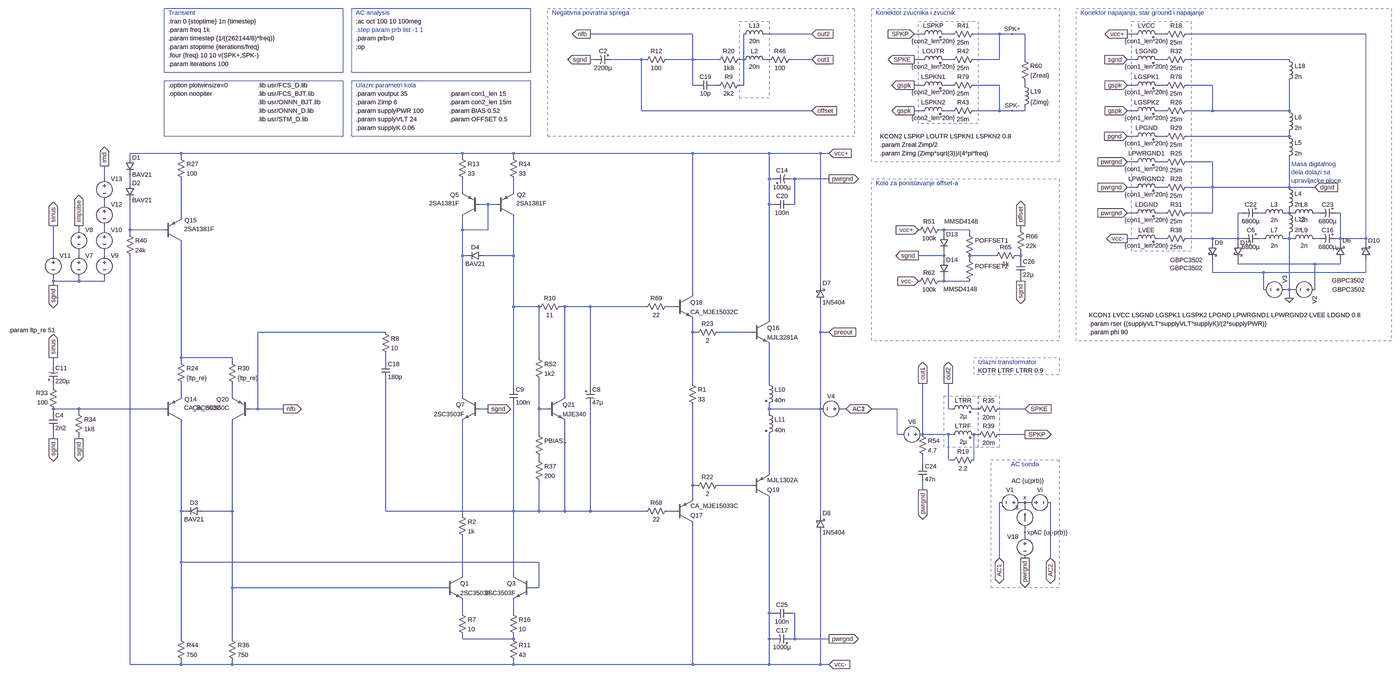
[diagram p0: schematic nano.asc, whole sheet]
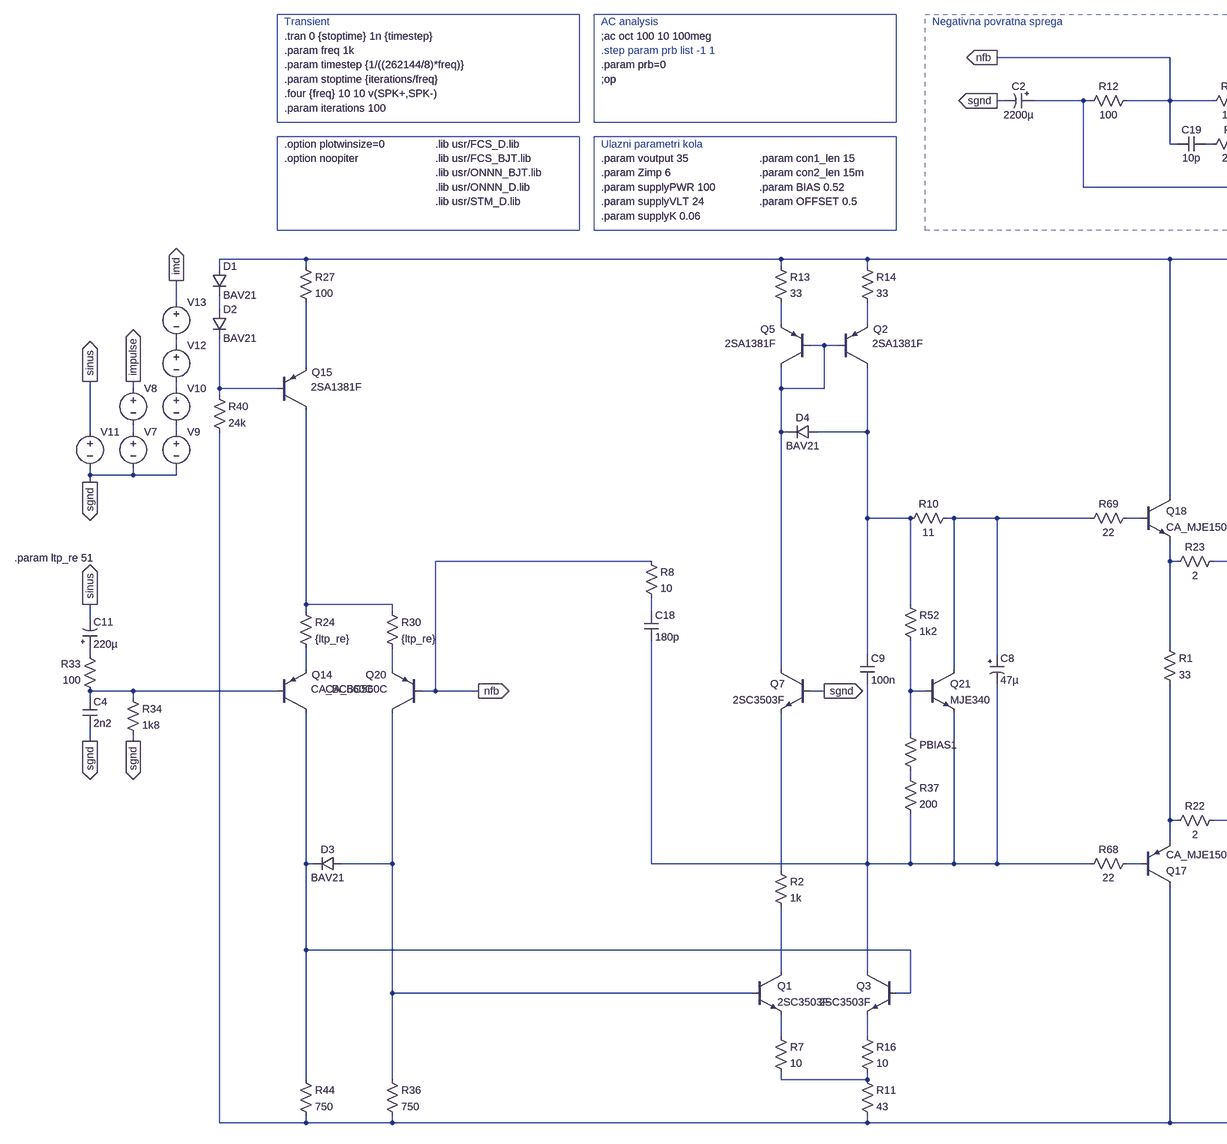
[diagram p1: schematic nano.asc, part, row 1 of 1, column 1 of 2]
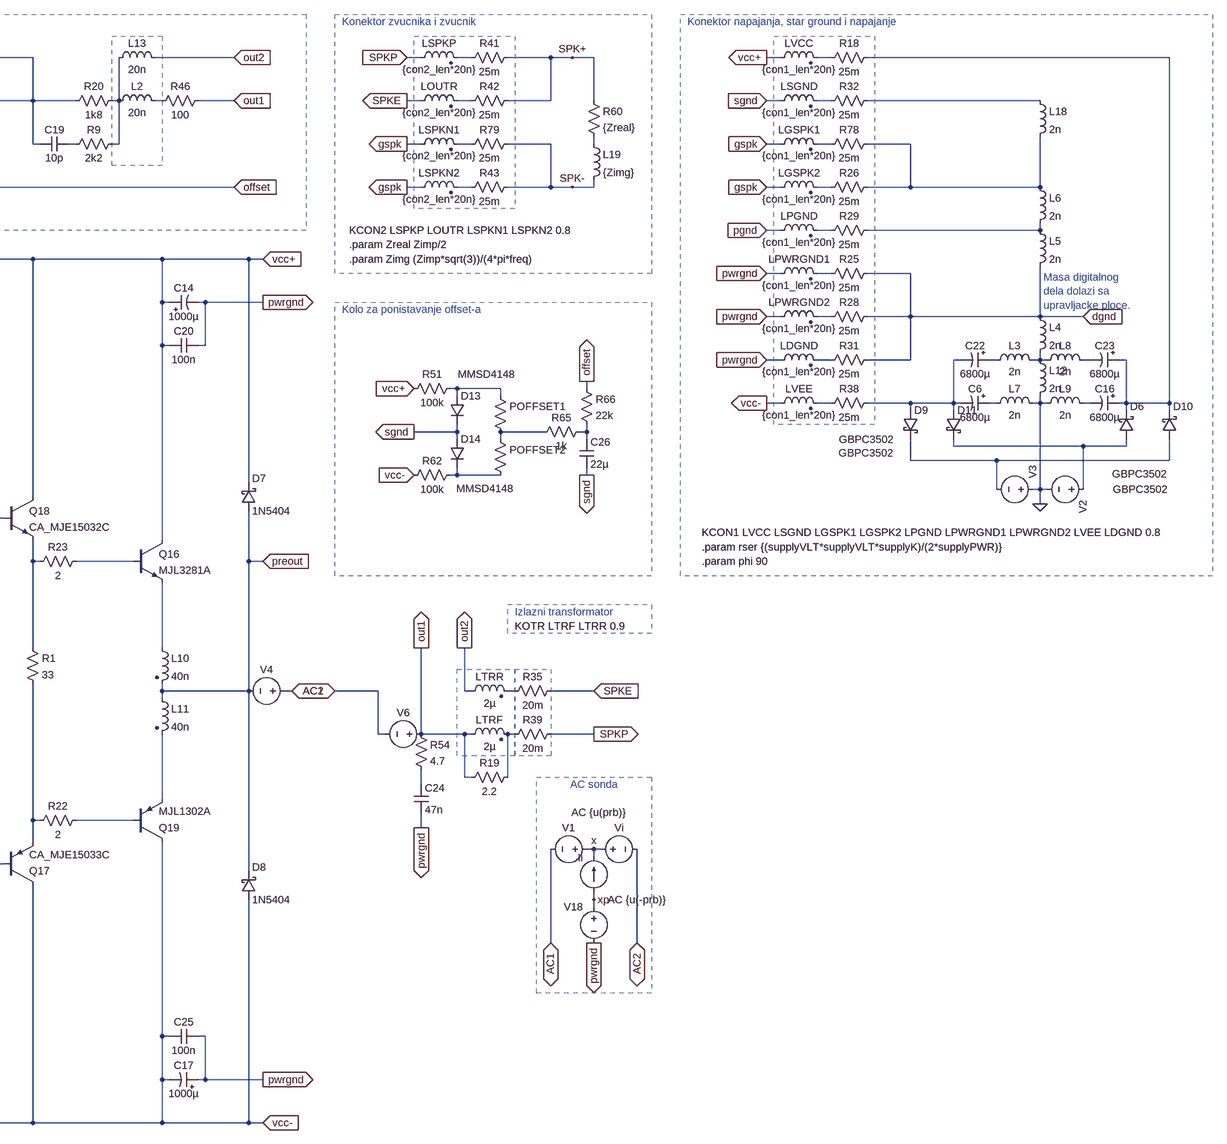
[diagram p2: schematic nano.asc, part, row 1 of 1, column 2 of 2]
nano.asc, the LTspice schematic file:
Version 4
SHEET 1 6124 2336
WIRE 1216 -1536 832 -1536
WIRE 1664 -1536 1488 -1536
WIRE 2080 -1536 2048 -1536
WIRE 2192 -1536 2160 -1536
WIRE 2368 -1536 2272 -1536
WIRE 2416 -1536 2368 -1536
WIRE 2464 -1536 2416 -1536
WIRE 2880 -1536 2848 -1536
WIRE 2992 -1536 2960 -1536
WIRE 3744 -1536 3072 -1536
WIRE 848 -1440 832 -1440
WIRE 1024 -1440 912 -1440
WIRE 1040 -1440 1024 -1440
WIRE 1216 -1440 1216 -1536
WIRE 1216 -1440 1120 -1440
WIRE 1312 -1440 1216 -1440
WIRE 1408 -1440 1408 -1536
WIRE 1408 -1440 1392 -1440
WIRE 1504 -1440 1488 -1440
WIRE 1664 -1440 1584 -1440
WIRE 2080 -1440 2048 -1440
WIRE 2192 -1440 2160 -1440
WIRE 2368 -1440 2368 -1536
WIRE 2368 -1440 2272 -1440
WIRE 2464 -1440 2464 -1536
WIRE 2880 -1440 2848 -1440
WIRE 2992 -1440 2960 -1440
WIRE 3456 -1440 3072 -1440
WIRE 1216 -1344 1216 -1440
WIRE 1232 -1344 1216 -1344
WIRE 1312 -1344 1296 -1344
WIRE 1408 -1344 1408 -1440
WIRE 1408 -1344 1392 -1344
WIRE 2080 -1344 2048 -1344
WIRE 2192 -1344 2160 -1344
WIRE 2368 -1344 2272 -1344
WIRE 2464 -1344 2464 -1360
WIRE 2880 -1344 2848 -1344
WIRE 2992 -1344 2960 -1344
WIRE 3168 -1344 3072 -1344
WIRE 1024 -1248 1024 -1440
WIRE 1664 -1248 1024 -1248
WIRE 2080 -1248 2048 -1248
WIRE 2192 -1248 2160 -1248
WIRE 2368 -1248 2368 -1344
WIRE 2368 -1248 2272 -1248
WIRE 2416 -1248 2368 -1248
WIRE 2464 -1248 2464 -1264
WIRE 2464 -1248 2416 -1248
WIRE 2880 -1248 2848 -1248
WIRE 2992 -1248 2960 -1248
WIRE 3168 -1248 3168 -1344
WIRE 3168 -1248 3072 -1248
WIRE 3456 -1248 3456 -1360
WIRE 3456 -1248 3168 -1248
WIRE 2880 -1152 2848 -1152
WIRE 2992 -1152 2960 -1152
WIRE 3456 -1152 3456 -1168
WIRE 3456 -1152 3072 -1152
WIRE -704 -1088 -896 -1088
WIRE 352 -1088 -704 -1088
WIRE 544 -1088 352 -1088
WIRE 1216 -1088 544 -1088
WIRE 1344 -1088 1216 -1088
WIRE 1504 -1088 1344 -1088
WIRE 1696 -1088 1504 -1088
WIRE 1728 -1088 1696 -1088
WIRE -896 -1072 -896 -1088
WIRE -704 -1072 -704 -1088
WIRE 352 -1072 352 -1088
WIRE 544 -1072 544 -1088
WIRE 2880 -1056 2848 -1056
WIRE 2992 -1056 2960 -1056
WIRE 3168 -1056 3072 -1056
WIRE -992 -992 -992 -1040
WIRE 1504 -992 1504 -1088
WIRE 1520 -992 1504 -992
WIRE 1600 -992 1584 -992
WIRE 1728 -992 1600 -992
WIRE -896 -976 -896 -1008
WIRE 2880 -960 2848 -960
WIRE 2992 -960 2960 -960
WIRE 3168 -960 3168 -1056
WIRE 3168 -960 3072 -960
WIRE 3456 -960 3456 -1072
WIRE 3456 -960 3168 -960
WIRE 3552 -960 3456 -960
WIRE 352 -944 352 -992
WIRE 544 -944 544 -992
WIRE -992 -896 -992 -912
WIRE 448 -896 416 -896
WIRE 480 -896 448 -896
WIRE 1504 -896 1504 -992
WIRE 1520 -896 1504 -896
WIRE 1600 -896 1600 -992
WIRE 1600 -896 1584 -896
WIRE 2880 -864 2848 -864
WIRE 2992 -864 2960 -864
WIRE 3168 -864 3168 -960
WIRE 3168 -864 3072 -864
WIRE 3280 -864 3264 -864
WIRE 3360 -864 3344 -864
WIRE 3456 -864 3456 -880
WIRE 3456 -864 3440 -864
WIRE 3472 -864 3456 -864
WIRE 3568 -864 3552 -864
WIRE 3648 -864 3632 -864
WIRE -704 -848 -704 -992
WIRE -1088 -800 -1088 -816
WIRE -992 -800 -992 -816
WIRE -896 -800 -896 -912
WIRE -768 -800 -896 -800
WIRE 352 -800 352 -848
WIRE 448 -800 448 -896
WIRE 448 -800 352 -800
WIRE 2160 -800 2144 -800
WIRE 2256 -800 2160 -800
WIRE 2448 -800 2448 -816
WIRE -896 -784 -896 -800
WIRE 2160 -784 2160 -800
WIRE 2256 -784 2256 -800
WIRE 2880 -768 2848 -768
WIRE 2992 -768 2960 -768
WIRE 3168 -768 3072 -768
WIRE 3264 -768 3264 -864
WIRE 3264 -768 3168 -768
WIRE 3280 -768 3264 -768
WIRE 3360 -768 3344 -768
WIRE 3456 -768 3456 -784
WIRE 3456 -768 3440 -768
WIRE 3472 -768 3456 -768
WIRE 3568 -768 3552 -768
WIRE 3648 -768 3648 -864
WIRE 3648 -768 3632 -768
WIRE 3744 -768 3744 -1536
WIRE 3744 -768 3648 -768
WIRE 3168 -752 3168 -768
WIRE 3264 -752 3264 -768
WIRE 3648 -752 3648 -768
WIRE 3744 -752 3744 -768
WIRE -1184 -704 -1184 -816
WIRE -1088 -704 -1088 -720
WIRE -992 -704 -992 -720
WIRE 352 -704 352 -800
WIRE 368 -704 352 -704
WIRE 544 -704 544 -848
WIRE 544 -704 432 -704
WIRE 1216 -704 1216 -1088
WIRE 1504 -704 1504 -896
WIRE 2160 -704 2160 -720
WIRE 2160 -704 2064 -704
WIRE 2352 -704 2256 -704
WIRE 2448 -704 2448 -720
WIRE 2448 -704 2432 -704
WIRE 2160 -688 2160 -704
WIRE 2256 -688 2256 -704
WIRE 2448 -688 2448 -704
WIRE 3264 -672 3264 -688
WIRE 3552 -672 3264 -672
WIRE 3648 -672 3648 -688
WIRE 3648 -672 3552 -672
WIRE 3168 -640 3168 -688
WIRE 3360 -640 3168 -640
WIRE 3744 -640 3744 -688
WIRE 3744 -640 3360 -640
WIRE -1184 -608 -1184 -624
WIRE -1088 -608 -1088 -624
WIRE -1088 -608 -1184 -608
WIRE -992 -608 -992 -624
WIRE -992 -608 -1088 -608
WIRE 2160 -608 2160 -624
WIRE 2160 -608 2144 -608
WIRE 2256 -608 2160 -608
WIRE 2448 -608 2448 -624
WIRE -1184 -592 -1184 -608
WIRE 1696 -592 1696 -1088
WIRE 3360 -576 3360 -640
WIRE 3456 -576 3456 -768
WIRE 3456 -576 3440 -576
WIRE 3472 -576 3456 -576
WIRE 3552 -576 3552 -672
WIRE 1216 -560 1216 -704
WIRE 3456 -544 3456 -576
WIRE 544 -512 544 -704
WIRE 640 -512 544 -512
WIRE 736 -512 720 -512
WIRE 832 -512 736 -512
WIRE 1040 -512 832 -512
WIRE 1152 -512 1120 -512
WIRE 1504 -464 1504 -704
WIRE 64 -416 -416 -416
WIRE 1216 -416 1216 -464
WIRE 1232 -416 1216 -416
WIRE 1440 -416 1312 -416
WIRE 1696 -416 1696 -528
WIRE 1728 -416 1696 -416
WIRE -704 -320 -704 -752
WIRE -512 -320 -704 -320
WIRE 640 -320 640 -512
WIRE -704 -304 -704 -320
WIRE -512 -304 -512 -320
WIRE 64 -304 64 -336
WIRE -1184 -288 -1184 -320
WIRE 1216 -224 1216 -416
WIRE 1504 -224 1504 -368
WIRE -1184 -208 -1184 -224
WIRE 544 -208 544 -512
WIRE 832 -208 832 -512
WIRE -704 -176 -704 -224
WIRE -512 -176 -512 -224
WIRE 352 -176 352 -704
WIRE 736 -176 736 -512
WIRE -1088 -128 -1184 -128
WIRE -768 -128 -1088 -128
WIRE -416 -128 -416 -416
WIRE -416 -128 -448 -128
WIRE -320 -128 -416 -128
WIRE 448 -128 416 -128
WIRE 640 -128 640 -240
WIRE 672 -128 640 -128
WIRE 1504 -128 1504 -144
WIRE 1600 -128 1504 -128
WIRE 1696 -128 1696 -416
WIRE 1696 -128 1600 -128
WIRE 1792 -128 1776 -128
WIRE 1984 -128 1888 -128
WIRE 2176 -128 2176 -224
WIRE 2192 -128 2176 -128
WIRE 2288 -128 2272 -128
WIRE 2464 -128 2368 -128
WIRE -1184 -112 -1184 -128
WIRE -1088 -112 -1088 -128
WIRE 1504 -112 1504 -128
WIRE 640 -32 640 -128
WIRE 1984 -32 1984 -128
WIRE 2000 -32 1984 -32
WIRE 2080 -32 2080 -224
WIRE 2176 -32 2080 -32
WIRE 2192 -32 2176 -32
WIRE 2288 -32 2272 -32
WIRE 2464 -32 2368 -32
WIRE -1184 -16 -1184 -48
WIRE -1088 -16 -1088 -32
WIRE 640 64 640 48
WIRE 2176 64 2176 -32
WIRE 2192 64 2176 64
WIRE 2272 64 2272 -32
WIRE 2080 80 2080 48
WIRE 1504 112 1504 -32
WIRE 1216 160 1216 -144
WIRE 1232 160 1216 160
WIRE 1440 160 1312 160
WIRE 2080 176 2080 144
WIRE 1216 208 1216 160
WIRE 2464 224 2448 224
WIRE 2480 224 2464 224
WIRE 2464 240 2464 224
WIRE -704 256 -704 -80
WIRE -688 256 -704 256
WIRE -512 256 -512 -80
WIRE -512 256 -624 256
WIRE 64 256 64 -240
WIRE 544 256 544 -144
WIRE 544 256 64 256
WIRE 640 256 640 144
WIRE 640 256 544 256
WIRE 736 256 736 -80
WIRE 736 256 640 256
WIRE 832 256 832 -144
WIRE 832 256 736 256
WIRE 1040 256 832 256
WIRE 1152 256 1120 256
WIRE 352 272 352 -80
WIRE 1696 272 1696 -128
WIRE 2464 336 2464 320
WIRE 2464 352 2464 336
WIRE 2368 432 2368 224
WIRE 2560 432 2560 224
WIRE -704 448 -704 256
WIRE 640 448 -704 448
WIRE 352 496 352 352
WIRE 544 496 544 256
WIRE -512 544 -512 256
WIRE 288 544 -512 544
WIRE 640 544 640 448
WIRE 640 544 608 544
WIRE 352 640 352 592
WIRE 544 640 544 592
WIRE 1504 640 1504 208
WIRE 1520 640 1504 640
WIRE 1600 640 1584 640
WIRE -704 736 -704 448
WIRE -512 736 -512 544
WIRE 352 736 352 720
WIRE 544 736 544 720
WIRE 544 736 352 736
WIRE 1504 736 1504 640
WIRE 1520 736 1504 736
WIRE 1600 736 1600 640
WIRE 1600 736 1584 736
WIRE 1728 736 1600 736
WIRE -896 832 -896 -704
WIRE -704 832 -704 816
WIRE -704 832 -896 832
WIRE -512 832 -512 816
WIRE -512 832 -704 832
WIRE 544 832 544 816
WIRE 544 832 -512 832
WIRE 1216 832 1216 304
WIRE 1216 832 544 832
WIRE 1344 832 1216 832
WIRE 1504 832 1504 736
WIRE 1504 832 1344 832
WIRE 1696 832 1696 336
WIRE 1696 832 1504 832
WIRE 1728 832 1696 832
FLAG 1728 -1088 vcc+
IOPIN 1728 -1088 In
FLAG 2464 224 x
FLAG 1728 832 vcc-
IOPIN 1728 832 In
FLAG 2080 -224 out1
IOPIN 2080 -224 Out
FLAG 832 -1536 nfb
IOPIN 832 -1536 Out
FLAG -320 -128 nfb
IOPIN -320 -128 Out
FLAG 2464 336 xp
FLAG 2080 176 pwrgnd
IOPIN 2080 176 Out
FLAG -1184 -16 sgnd
IOPIN -1184 -16 Out
FLAG -1088 -16 sgnd
IOPIN -1088 -16 Out
FLAG 832 -1440 sgnd
IOPIN 832 -1440 Out
FLAG 1728 -992 pwrgnd
IOPIN 1728 -992 Out
FLAG 2176 -224 out2
IOPIN 2176 -224 Out
FLAG -1184 -592 sgnd
IOPIN -1184 -592 Out
FLAG -1184 -816 sinus
IOPIN -1184 -816 Out
FLAG 1728 736 pwrgnd
IOPIN 1728 736 Out
FLAG 2848 -1536 vcc+
IOPIN 2848 -1536 Out
FLAG 2848 -768 vcc-
IOPIN 2848 -768 Out
FLAG 2848 -1248 gspk
IOPIN 2848 -1248 In
FLAG 2848 -960 pwrgnd
IOPIN 2848 -960 In
FLAG 2848 -1152 pgnd
IOPIN 2848 -1152 In
FLAG 2848 -1440 sgnd
IOPIN 2848 -1440 In
FLAG 1664 -1440 out1
IOPIN 1664 -1440 In
FLAG 1664 -1536 out2
IOPIN 1664 -1536 In
FLAG 2464 -32 SPKP
IOPIN 2464 -32 Out
FLAG 2048 -1248 gspk
IOPIN 2048 -1248 Out
FLAG 2048 -1536 SPKP
IOPIN 2048 -1536 In
FLAG 2048 -1440 SPKE
IOPIN 2048 -1440 Out
FLAG 3552 -960 dgnd
IOPIN 3552 -960 In
FLAG 2848 -1056 pwrgnd
IOPIN 2848 -1056 In
FLAG -1088 -816 impulse
IOPIN -1088 -816 Out
FLAG 2848 -864 pwrgnd
IOPIN 2848 -864 In
FLAG 3456 -544 0
FLAG 2064 -800 vcc+
IOPIN 2064 -800 In
FLAG 2064 -608 vcc-
IOPIN 2064 -608 In
FLAG 2064 -704 sgnd
IOPIN 2064 -704 Out
FLAG 2448 -608 sgnd
IOPIN 2448 -608 Out
FLAG 2448 -816 offset
IOPIN 2448 -816 Out
FLAG 1664 -1248 offset
IOPIN 1664 -1248 In
FLAG 2368 432 AC1
IOPIN 2368 432 BiDir
FLAG 2560 432 AC2
IOPIN 2560 432 BiDir
FLAG 1792 -128 AC1
IOPIN 1792 -128 BiDir
FLAG 1888 -128 AC2
IOPIN 1888 -128 BiDir
FLAG 2464 432 pwrgnd
IOPIN 2464 432 Out
FLAG 2416 -1536 SPK+
FLAG 2416 -1248 SPK-
FLAG 2464 -128 SPKE
IOPIN 2464 -128 In
FLAG 2848 -1344 gspk
IOPIN 2848 -1344 In
FLAG 2048 -1344 gspk
IOPIN 2048 -1344 Out
FLAG 1728 -416 preout
IOPIN 1728 -416 In
FLAG -992 -1040 imd
IOPIN -992 -1040 Out
FLAG 448 -128 sgnd
IOPIN 448 -128 Out
FLAG -1184 -320 sinus
IOPIN -1184 -320 Out
DATAFLAG 1600 -128 ""
DATAFLAG 1504 -704 "ic(q16)"
DATAFLAG 1344 -1088 ""
DATAFLAG 1344 832 ""
DATAFLAG 1216 -704 "Ic(Q18)"
SYMBOL res 1136 -1456 R90
WINDOW 0 0 56 VBottom 2
WINDOW 3 32 56 VTop 2
SYMATTR InstName R12
SYMATTR Value 100
SYMBOL voltage 3568 -576 R90
WINDOW 123 0 0 Left 2
WINDOW 3 -94 177 Invisible 2
SYMATTR Value SINE(0 {supplyVLT*sqrt(2)} 50 0 0 {phi})
SYMATTR SpiceLine Rser={rser}
SYMATTR InstName V2
SYMBOL current 2464 320 R180
WINDOW 0 24 77 Left 2
WINDOW 3 24 0 Invisible 2
WINDOW 123 -71 178 Left 2
WINDOW 39 0 0 Left 2
SYMATTR InstName Ii
SYMATTR Value 0
SYMATTR Value2 AC {u(prb)}
SYMBOL voltage 2464 224 R270
WINDOW 0 32 56 VTop 2
WINDOW 3 -32 56 Invisible 2
WINDOW 123 -97 96 VBottom 2
WINDOW 39 -32 56 VBottom 2
SYMATTR InstName Vi
SYMATTR Value 0
SYMATTR Value2 AC {u(-prb)}
SYMBOL res -1168 -112 R180
WINDOW 0 36 76 Left 2
WINDOW 3 36 40 Left 2
SYMATTR InstName R33
SYMATTR Value 100
SYMBOL res -1104 -128 R0
SYMATTR InstName R34
SYMATTR Value 1k8
SYMBOL schottky 1680 -528 M180
WINDOW 0 24 72 Left 2
WINDOW 3 24 0 Left 2
SYMATTR InstName D7
SYMATTR Value 1N5404
SYMATTR Description Diode
SYMATTR Type diode
SYMBOL schottky 1680 336 M180
WINDOW 0 24 72 Left 2
WINDOW 3 24 0 Left 2
SYMATTR InstName D8
SYMATTR Value 1N5404
SYMATTR Description Diode
SYMATTR Type diode
SYMBOL ind2 2176 -16 R270
WINDOW 0 32 56 VTop 2
WINDOW 3 4 56 VBottom 2
SYMATTR InstName LTRF
SYMATTR Value 2µ
SYMATTR SpiceLine Rser=10m Rpar=3meg Cpar=1p
SYMATTR Type ind
SYMBOL res 2176 80 R270
WINDOW 0 32 56 VTop 2
WINDOW 3 0 56 VBottom 2
SYMATTR InstName R19
SYMATTR Value 2.2
SYMBOL res 1408 -1456 R90
WINDOW 0 0 56 VBottom 2
WINDOW 3 32 56 VTop 2
SYMATTR InstName R20
SYMATTR Value 1k8
SYMBOL voltage 2464 224 R90
WINDOW 0 -32 56 VBottom 2
WINDOW 3 32 56 Invisible 2
WINDOW 123 0 0 Left 2
WINDOW 39 0 0 Left 2
SYMATTR InstName V1
SYMATTR Value 0
SYMBOL schottky 3632 -688 M180
WINDOW 0 24 72 Left 2
WINDOW 3 -14 -112 Left 2
SYMATTR InstName D6
SYMATTR Value GBPC3502
SYMATTR Description Diode
SYMATTR Type diode
SYMBOL schottky 3152 -752 R0
WINDOW 3 -144 95 Left 2
SYMATTR Value GBPC3502
SYMATTR InstName D9
SYMATTR Description Diode
SYMATTR Type diode
SYMBOL voltage 3456 -576 M270
WINDOW 123 0 0 Left 2
WINDOW 3 -96 -62 Invisible 2
SYMATTR Value SINE(0 {supplyVLT*sqrt(2)} 50 0 0 {phi})
SYMATTR SpiceLine Rser={rser}
SYMATTR InstName V3
SYMBOL res 2064 -48 R0
SYMATTR InstName R54
SYMATTR Value 4.7
SYMBOL res 2448 -1456 R0
SYMATTR InstName R60
SYMATTR Value {Zreal}
SYMBOL ind 2448 -1360 R0
SYMATTR InstName L19
SYMATTR Value {Zimg}
SYMATTR SpiceLine Cpar=10p
SYMBOL voltage 2464 336 M0
WINDOW 123 0 0 Left 2
WINDOW 39 0 0 Left 2
WINDOW 3 24 96 Invisible 2
SYMATTR Value 0
SYMATTR InstName V18
SYMBOL npn 1440 -464 R0
SYMATTR InstName Q16
SYMATTR Value MJL3281A
SYMBOL pnp 1152 304 M180
SYMATTR InstName Q17
SYMATTR Value CA_MJE15033C
SYMBOL npn 1152 -560 R0
SYMATTR InstName Q18
SYMATTR Value CA_MJE15032C
SYMBOL pnp 1440 208 M180
SYMATTR InstName Q19
SYMATTR Value MJL1302A
SYMBOL res 1328 144 R90
WINDOW 0 0 56 VBottom 2
WINDOW 3 32 56 VTop 2
SYMATTR InstName R22
SYMATTR Value 2
SYMBOL res 1328 -432 R90
WINDOW 0 0 56 VBottom 2
WINDOW 3 32 56 VTop 2
SYMATTR InstName R23
SYMATTR Value 2
SYMBOL cap 1520 -912 M90
WINDOW 0 0 32 VBottom 2
WINDOW 3 32 32 VTop 2
SYMATTR InstName C20
SYMATTR Value 100n
SYMATTR SpiceLine Rser=700m Lser=7n Rpar=4.4meg Cpar=1p
SYMBOL ind2 1488 -240 R0
SYMATTR InstName L10
SYMATTR Value 40n
SYMATTR SpiceLine Rser=220m Cpar=3p
SYMATTR Type ind
SYMBOL ind2 1488 -128 R0
SYMATTR InstName L11
SYMATTR Value 40n
SYMATTR SpiceLine Rser=220m Cpar=3p
SYMATTR Type ind
SYMBOL cap 2064 80 R0
SYMATTR InstName C24
SYMATTR Value 47n
SYMATTR SpiceLine Rser=700m Lser=7n Rpar=4.4meg Cpar=1p
SYMBOL cap 1584 624 R90
WINDOW 0 0 32 VBottom 2
WINDOW 3 32 32 VTop 2
SYMATTR InstName C25
SYMATTR Value 100n
SYMATTR SpiceLine Rser=700m Lser=7n Rpar=4.4meg Cpar=1p
SYMBOL polcap 912 -1456 R90
WINDOW 0 0 32 VBottom 2
WINDOW 3 32 32 VTop 2
SYMATTR InstName C2
SYMATTR Value 2200µ
SYMATTR SpiceLine V=10 Irms=1.25 Rser=0.08 Lser=10n Rpar=110k Cpar=3p
SYMATTR Description Capacitor
SYMATTR Type cap
SYMBOL polcap 3344 -784 R90
WINDOW 0 0 32 VBottom 2
WINDOW 3 32 32 VTop 2
SYMATTR InstName C6
SYMATTR Value 6800µ
SYMATTR SpiceLine V=50 Irms=2.5 Rser=0.08 Lser=20n Rpar=40k Cpar=3p mfg="Nichicon" pn="UVZ1H682MRD" type="Al electrolytic"
SYMATTR Description Capacitor
SYMATTR Type cap
SYMBOL res 624 -48 R0
WINDOW 3 36 76 Invisible 2
SYMATTR Value {1+(500*BIAS)}
SYMATTR InstName PBIAS1
SYMBOL res 624 -336 R0
SYMATTR InstName R52
SYMATTR Value 1k2
SYMBOL schottky 3728 -688 M180
WINDOW 0 24 72 Left 2
WINDOW 3 -112 -78 Left 2
SYMATTR InstName D10
SYMATTR Value GBPC3502
SYMATTR Description Diode
SYMATTR Type diode
SYMBOL schottky 3248 -752 R0
WINDOW 3 -239 65 Left 2
SYMATTR Value GBPC3502
SYMATTR InstName D11
SYMATTR Description Diode
SYMATTR Type diode
SYMBOL ind2 2864 -1520 R270
WINDOW 0 32 56 VTop 2
WINDOW 3 5 56 VBottom 2
SYMATTR InstName LVCC
SYMATTR Value {con1_len*20n}
SYMATTR SpiceLine Rser={con1_len*.5m}
SYMATTR Type ind
SYMBOL ind2 2864 -752 R270
WINDOW 0 32 56 VTop 2
WINDOW 3 5 56 VBottom 2
SYMATTR InstName LVEE
SYMATTR Value {con1_len*20n}
SYMATTR SpiceLine Rser={con1_len*.5m}
SYMATTR Type ind
SYMBOL res 1600 -1456 R90
WINDOW 0 0 56 VBottom 2
WINDOW 3 32 56 VTop 2
SYMATTR InstName R46
SYMATTR Value 100
SYMBOL ind2 2176 -112 R270
WINDOW 0 32 56 VTop 2
WINDOW 3 4 56 VBottom 2
SYMATTR InstName LTRR
SYMATTR Value 2µ
SYMATTR SpiceLine Rser=80m Rpar=3meg Cpar=1p
SYMATTR Type ind
SYMBOL npn 608 496 M0
SYMATTR InstName Q3
SYMATTR Value 2SC3503F
SYMBOL cap -1200 -48 M180
WINDOW 0 24 56 Left 2
WINDOW 3 24 8 Left 2
SYMATTR InstName C4
SYMATTR Value 2n2
SYMBOL voltage -1184 -720 R0
WINDOW 123 24 44 Left 2
WINDOW 39 0 0 Left 2
WINDOW 3 24 96 Invisible 2
SYMATTR Value SINE(0 {voutput/18} {freq})
SYMATTR InstName V11
SYMBOL res 1200 -240 R0
SYMATTR InstName R1
SYMATTR Value 33
SYMBOL npn 672 -176 R0
SYMATTR InstName Q21
SYMATTR Value MJE340
SYMBOL ind2 2864 -1232 R270
WINDOW 0 32 56 VTop 2
WINDOW 3 5 56 VBottom 2
SYMATTR InstName LGSPK2
SYMATTR Value {con1_len*20n}
SYMATTR SpiceLine Rser={con1_len*.5m}
SYMATTR Type ind
SYMBOL ind2 2864 -944 R270
WINDOW 0 32 56 VTop 2
WINDOW 3 5 56 VBottom 2
SYMATTR InstName LPWRGND2
SYMATTR Value {con1_len*20n}
SYMATTR SpiceLine Rser={con1_len*.5m}
SYMATTR Type ind
SYMBOL ind2 2864 -1136 R270
WINDOW 0 32 56 VTop 2
WINDOW 3 5 56 VBottom 2
SYMATTR InstName LPGND
SYMATTR Value {con1_len*20n}
SYMATTR SpiceLine Rser={con1_len*.5m}
SYMATTR Type ind
SYMBOL ind2 2864 -1424 R270
WINDOW 0 32 56 VTop 2
WINDOW 3 5 56 VBottom 2
SYMATTR InstName LSGND
SYMATTR Value {con1_len*20n}
SYMATTR SpiceLine Rser={con1_len*.5m}
SYMATTR Type ind
SYMBOL res 3088 -1552 R90
WINDOW 0 0 56 VBottom 2
WINDOW 3 32 56 VTop 2
SYMATTR InstName R18
SYMATTR Value 25m
SYMBOL res 3088 -1264 R90
WINDOW 0 0 56 VBottom 2
WINDOW 3 32 56 VTop 2
SYMATTR InstName R26
SYMATTR Value 25m
SYMBOL res 3088 -976 R90
WINDOW 0 0 56 VBottom 2
WINDOW 3 32 56 VTop 2
SYMATTR InstName R28
SYMATTR Value 25m
SYMBOL res 3088 -1168 R90
WINDOW 0 0 56 VBottom 2
WINDOW 3 32 56 VTop 2
SYMATTR InstName R29
SYMATTR Value 25m
SYMBOL res 3088 -1456 R90
WINDOW 0 0 56 VBottom 2
WINDOW 3 32 56 VTop 2
SYMATTR InstName R32
SYMATTR Value 25m
SYMBOL res 3088 -784 R90
WINDOW 0 0 56 VBottom 2
WINDOW 3 32 56 VTop 2
SYMATTR InstName R38
SYMATTR Value 25m
SYMBOL ind 3440 -976 R0
SYMATTR InstName L4
SYMATTR Value 2n
SYMATTR SpiceLine Rser=1m
SYMBOL ind 3440 -1168 R0
SYMATTR InstName L5
SYMATTR Value 2n
SYMATTR SpiceLine Rser=1m
SYMBOL ind 3440 -1264 R0
SYMATTR InstName L6
SYMATTR Value 2n
SYMATTR SpiceLine Rser=1m
SYMBOL ind 3440 -1456 R0
SYMATTR InstName L18
SYMATTR Value 2n
SYMATTR SpiceLine Rser=1m
SYMBOL ind2 2064 -1520 R270
WINDOW 0 32 56 VTop 2
WINDOW 3 5 56 VBottom 2
SYMATTR InstName LSPKP
SYMATTR Value {con2_len*20n}
SYMATTR SpiceLine Rser={con2_len*.5m}
SYMATTR Type ind
SYMBOL ind2 2064 -1424 R270
WINDOW 0 32 56 VTop 2
WINDOW 3 5 56 VBottom 2
SYMATTR InstName LOUTR
SYMATTR Value {con2_len*20n}
SYMATTR SpiceLine Rser={con2_len*.5m}
SYMATTR Type ind
SYMBOL ind2 2064 -1232 R270
WINDOW 0 32 56 VTop 2
WINDOW 3 5 56 VBottom 2
SYMATTR InstName LSPKN2
SYMATTR Value {con2_len*20n}
SYMATTR SpiceLine Rser={con2_len*.5m}
SYMATTR Type ind
SYMBOL res 2384 -144 R90
WINDOW 0 0 56 VBottom 2
WINDOW 3 32 56 VTop 2
SYMATTR InstName R35
SYMATTR Value 20m
SYMBOL res 2384 -48 R90
WINDOW 0 0 56 VBottom 2
WINDOW 3 32 56 VTop 2
SYMATTR InstName R39
SYMATTR Value 20m
SYMBOL res 2288 -1552 R90
WINDOW 0 0 56 VBottom 2
WINDOW 3 32 56 VTop 2
SYMATTR InstName R41
SYMATTR Value 25m
SYMBOL res 2288 -1456 R90
WINDOW 0 0 56 VBottom 2
WINDOW 3 32 56 VTop 2
SYMATTR InstName R42
SYMATTR Value 25m
SYMBOL res 2288 -1264 R90
WINDOW 0 0 56 VBottom 2
WINDOW 3 32 56 VTop 2
SYMATTR InstName R43
SYMATTR Value 25m
SYMBOL ind2 2864 -848 R270
WINDOW 0 32 56 VTop 2
WINDOW 3 5 56 VBottom 2
SYMATTR InstName LDGND
SYMATTR Value {con1_len*20n}
SYMATTR SpiceLine Rser={con1_len*.5m}
SYMATTR Type ind
SYMBOL res 3088 -880 R90
WINDOW 0 0 56 VBottom 2
WINDOW 3 32 56 VTop 2
SYMATTR InstName R31
SYMATTR Value 25m
SYMBOL ind2 2864 -1040 R270
WINDOW 0 32 56 VTop 2
WINDOW 3 5 56 VBottom 2
SYMATTR InstName LPWRGND1
SYMATTR Value {con1_len*20n}
SYMATTR SpiceLine Rser={con1_len*.5m}
SYMATTR Type ind
SYMBOL res 3088 -1072 R90
WINDOW 0 0 56 VBottom 2
WINDOW 3 32 56 VTop 2
SYMATTR InstName R25
SYMATTR Value 25m
SYMBOL voltage -1088 -720 R0
WINDOW 3 24 96 Invisible 2
WINDOW 123 0 0 Left 2
WINDOW 39 0 0 Left 2
SYMATTR Value PULSE(0 {voutput/18} 1u 1n 1n {1/(freq*2)} {1/freq})
SYMATTR InstName V7
SYMBOL voltage -1088 -816 R0
WINDOW 3 24 96 Invisible 2
WINDOW 123 0 0 Left 2
WINDOW 39 0 0 Left 2
SYMATTR Value PULSE(0 {-voutput/18} {1u+(1/(freq*2))} 1n 1n {1/(freq*2)} {1/freq})
SYMATTR InstName V8
SYMBOL polcap -1200 -224 M180
WINDOW 3 24 8 Left 2
WINDOW 0 24 57 Left 2
SYMATTR Value 220µ
SYMATTR InstName C11
SYMATTR SpiceLine V=6.3 Irms=290m Rser=0.5 Lser=3n Rpar=100k Cpar=3p mfg="Nichicon" pn="UPW0J221MED1TD" type="Al electrolytic"
SYMATTR Description Capacitor
SYMATTR Type cap
SYMBOL polcap 1520 -976 R270
WINDOW 0 32 32 VTop 2
WINDOW 3 0 32 VBottom 2
SYMATTR InstName C14
SYMATTR Value 1000µ
SYMATTR SpiceLine V=63 Irms=2.77 Rser=0.036 Lser=5n Rpar=100k Cpar=3p mfg="Nichicon" pn="UPW1J102MHD6" type="Al electrolytic"
SYMATTR Description Capacitor
SYMATTR Type cap
SYMBOL polcap 1584 752 M270
WINDOW 0 32 32 VTop 2
WINDOW 3 0 32 VBottom 2
SYMATTR InstName C17
SYMATTR Value 1000µ
SYMATTR SpiceLine V=63 Irms=2.77 Rser=0.036 Lser=5n Rpar=100k Cpar=3p mfg="Nichicon" pn="UPW1J102MHD6" type="Al electrolytic"
SYMATTR Description Capacitor
SYMATTR Type cap
SYMBOL polcap 3632 -784 R90
WINDOW 0 0 32 VBottom 2
WINDOW 3 32 32 VTop 2
SYMATTR InstName C16
SYMATTR Value 6800µ
SYMATTR SpiceLine V=50 Irms=2.5 Rser=0.08 Lser=20n Rpar=40k Cpar=3p mfg="Nichicon" pn="UVZ1H682MRD" type="Al electrolytic"
SYMATTR Description Capacitor
SYMATTR Type cap
SYMBOL polcap 3344 -880 R90
WINDOW 0 0 32 VBottom 2
WINDOW 3 32 32 VTop 2
SYMATTR InstName C22
SYMATTR Value 6800µ
SYMATTR SpiceLine V=50 Irms=2.5 Rser=0.08 Lser=20n Rpar=40k Cpar=3p mfg="Nichicon" pn="UVZ1H682MRD" type="Al electrolytic"
SYMATTR Description Capacitor
SYMATTR Type cap
SYMBOL polcap 3632 -880 R90
WINDOW 0 0 32 VBottom 2
WINDOW 3 32 32 VTop 2
SYMATTR InstName C23
SYMATTR Value 6800µ
SYMATTR SpiceLine V=50 Irms=2.5 Rser=0.08 Lser=20n Rpar=40k Cpar=3p mfg="Nichicon" pn="UVZ1H682MRD" type="Al electrolytic"
SYMATTR Description Capacitor
SYMATTR Type cap
SYMBOL ind 3344 -848 R270
WINDOW 0 32 56 VTop 2
WINDOW 3 5 56 VBottom 2
SYMATTR InstName L3
SYMATTR Value 2n
SYMATTR SpiceLine Rser=1m
SYMBOL ind 3344 -752 R270
WINDOW 0 32 56 VTop 2
WINDOW 3 5 56 VBottom 2
SYMATTR InstName L7
SYMATTR Value 2n
SYMATTR SpiceLine Rser=1m
SYMBOL ind 3456 -848 R270
WINDOW 0 32 56 VTop 2
WINDOW 3 5 56 VBottom 2
SYMATTR InstName L8
SYMATTR Value 2n
SYMATTR SpiceLine Rser=1m
SYMBOL ind 3456 -752 R270
WINDOW 0 32 56 VTop 2
WINDOW 3 5 56 VBottom 2
SYMATTR InstName L9
SYMATTR Value 2n
SYMATTR SpiceLine Rser=1m
SYMBOL ind 3440 -880 R0
SYMATTR InstName L12
SYMATTR Value 2n
SYMATTR SpiceLine Rser=1m
SYMBOL res 624 48 R0
SYMATTR InstName R37
SYMATTR Value 200
SYMBOL res 2048 -784 R270
WINDOW 0 32 56 VTop 2
WINDOW 3 0 56 VBottom 2
SYMATTR InstName R51
SYMATTR Value 100k
SYMBOL res 2160 -624 R90
WINDOW 0 0 56 VBottom 2
WINDOW 3 32 56 VTop 2
SYMATTR InstName R62
SYMATTR Value 100k
SYMBOL diode 2144 -784 R0
WINDOW 3 17 -48 Left 2
SYMATTR Value MMSD4148
SYMATTR InstName D13
SYMBOL diode 2144 -688 R0
WINDOW 3 14 110 Left 2
SYMATTR Value MMSD4148
SYMATTR InstName D14
SYMBOL res 2240 -800 R0
WINDOW 3 45 -160 Invisible 2
SYMATTR Value {1+(10k*OFFSET)}
SYMATTR InstName POFFSET1
SYMBOL res 2240 -704 R0
WINDOW 3 49 222 Invisible 2
SYMATTR Value {1+(10k*(1-OFFSET))}
SYMATTR InstName POFFSET2
SYMBOL res 2448 -720 R90
WINDOW 0 0 56 VBottom 2
WINDOW 3 32 56 VTop 2
SYMATTR InstName R65
SYMATTR Value 1k
SYMBOL cap 2432 -624 M180
WINDOW 0 24 57 Left 2
WINDOW 3 24 8 Left 2
SYMATTR InstName C26
SYMATTR Value 22µ
SYMATTR SpiceLine V=50 Irms=90m Rser=2 Lser=2n Rpar=2meg Cpar=2p mfg="Panasonic" pn="ECEA1HN220U" type="Al bipolar"
SYMBOL res 2432 -816 R0
SYMATTR InstName R66
SYMATTR Value 22k
SYMBOL voltage 1792 -128 R90
WINDOW 0 -32 56 VBottom 2
WINDOW 3 32 56 Invisible 2
WINDOW 123 0 0 Left 2
WINDOW 39 0 0 Left 2
SYMATTR InstName V4
SYMATTR Value 0
SYMBOL voltage 2096 -32 R90
WINDOW 0 -32 56 VBottom 2
WINDOW 3 32 56 Invisible 2
WINDOW 123 0 0 Left 2
WINDOW 39 0 0 Left 2
SYMATTR InstName V6
SYMATTR Value 0
SYMBOL res 1136 240 R90
WINDOW 0 0 56 VBottom 2
WINDOW 3 32 56 VTop 2
SYMATTR InstName R68
SYMATTR Value 22
SYMBOL res 1136 -528 R90
WINDOW 0 0 56 VBottom 2
WINDOW 3 32 56 VTop 2
SYMATTR InstName R69
SYMATTR Value 22
SYMBOL ind2 2864 -1328 R270
WINDOW 0 32 56 VTop 2
WINDOW 3 5 56 VBottom 2
SYMATTR InstName LGSPK1
SYMATTR Value {con1_len*20n}
SYMATTR SpiceLine Rser={con1_len*.5m}
SYMATTR Type ind
SYMBOL res 3088 -1360 R90
WINDOW 0 0 56 VBottom 2
WINDOW 3 32 56 VTop 2
SYMATTR InstName R78
SYMATTR Value 25m
SYMBOL ind2 2064 -1328 R270
WINDOW 0 32 56 VTop 2
WINDOW 3 5 56 VBottom 2
SYMATTR InstName LSPKN1
SYMATTR Value {con2_len*20n}
SYMATTR SpiceLine Rser={con2_len*.5m}
SYMATTR Type ind
SYMBOL res 2288 -1360 R90
WINDOW 0 0 56 VBottom 2
WINDOW 3 32 56 VTop 2
SYMATTR InstName R79
SYMATTR Value 25m
SYMBOL voltage -992 -720 R0
WINDOW 3 24 96 Invisible 2
WINDOW 123 0 0 Left 2
WINDOW 39 0 0 Left 2
SYMATTR Value SINE(0 {voutput/72} 19k)
SYMATTR InstName V9
SYMBOL voltage -992 -816 R0
WINDOW 3 24 96 Invisible 2
WINDOW 123 0 0 Left 2
WINDOW 39 0 0 Left 2
SYMATTR Value SINE(0 {voutput/72} 17k)
SYMATTR InstName V10
SYMBOL ind 1392 -1424 R270
WINDOW 0 32 56 VTop 2
WINDOW 3 5 56 VBottom 2
SYMATTR InstName L2
SYMATTR Value 20n
SYMBOL ind 1392 -1520 R270
WINDOW 0 32 56 VTop 2
WINDOW 3 5 56 VBottom 2
SYMATTR InstName L13
SYMATTR Value 20n
SYMBOL npn 288 496 R0
SYMATTR InstName Q1
SYMATTR Value 2SC3503F
SYMBOL res 736 -528 R90
WINDOW 0 0 56 VBottom 2
WINDOW 3 32 56 VTop 2
SYMATTR InstName R10
SYMATTR Value 11
SYMBOL polcap 816 -208 R0
SYMATTR Value 47µ
SYMATTR InstName C8
SYMATTR SpiceLine V=6.3 Irms=290m Rser=0.5 Lser=3n Rpar=100k Cpar=3p mfg="Nichicon" pn="UPW0J221MED1TD" type="Al electrolytic"
SYMATTR Description Capacitor
SYMATTR Type cap
SYMBOL res 336 -1088 R0
SYMATTR InstName R13
SYMATTR Value 33
SYMBOL res 528 -1088 R0
SYMATTR InstName R14
SYMATTR Value 33
SYMBOL cap 48 -304 R0
SYMATTR InstName C18
SYMATTR Value 180p
SYMBOL pnp -768 -80 M180
WINDOW 0 77 84 Left 2
WINDOW 3 75 52 Left 2
SYMATTR InstName Q14
SYMATTR Value CA_BC560C
SYMBOL pnp -448 -80 R180
WINDOW 0 77 84 Left 2
WINDOW 3 75 52 Left 2
SYMATTR InstName Q20
SYMATTR Value CA_BC560C
SYMBOL res 528 720 R0
SYMATTR InstName R11
SYMATTR Value 43
SYMBOL res -528 720 R0
SYMATTR InstName R36
SYMATTR Value 750
SYMBOL res -720 720 R0
SYMATTR InstName R44
SYMATTR Value 750
SYMBOL pnp -768 -752 M180
WINDOW 0 77 84 Left 2
WINDOW 3 75 52 Left 2
SYMATTR InstName Q15
SYMATTR Value 2SA1381F
SYMBOL res -720 -1088 R0
SYMATTR InstName R27
SYMATTR Value 100
SYMBOL res -912 -800 R0
SYMATTR InstName R40
SYMATTR Value 24k
SYMBOL cap 528 -208 R0
SYMATTR InstName C9
SYMATTR Value 100n
SYMATTR SpiceLine Rser=30m Lser=3n Rpar=700k
SYMBOL res 48 -432 R0
SYMATTR InstName R8
SYMATTR Value 10
SYMBOL res 1408 -1360 R90
WINDOW 0 0 56 VBottom 2
WINDOW 3 32 56 VTop 2
SYMATTR InstName R9
SYMATTR Value 2k2
SYMBOL cap 1296 -1360 R90
WINDOW 0 0 32 VBottom 2
WINDOW 3 32 32 VTop 2
SYMATTR InstName C19
SYMATTR Value 10p
SYMBOL voltage -992 -912 R0
WINDOW 3 24 96 Invisible 2
WINDOW 123 0 0 Left 2
WINDOW 39 0 0 Left 2
SYMATTR Value SINE(0 {voutput/72} 3k)
SYMATTR InstName V12
SYMBOL voltage -992 -1008 R0
WINDOW 3 24 96 Invisible 2
WINDOW 123 0 0 Left 2
WINDOW 39 0 0 Left 2
SYMATTR Value SINE(0 {voutput/72} 5k)
SYMATTR InstName V13
SYMBOL diode -912 -1072 R0
SYMATTR InstName D1
SYMATTR Value BAV21
SYMBOL diode -912 -976 R0
SYMATTR InstName D2
SYMATTR Value BAV21
SYMBOL res -720 -320 R0
SYMATTR InstName R24
SYMATTR Value {ltp_re}
SYMBOL res -528 -320 R0
SYMATTR InstName R30
SYMATTR Value {ltp_re}
SYMBOL pnp 480 -848 M180
WINDOW 0 77 84 Left 2
WINDOW 3 75 52 Left 2
SYMATTR InstName Q2
SYMATTR Value 2SA1381F
SYMBOL pnp 416 -848 R180
WINDOW 0 77 84 Left 2
WINDOW 3 75 52 Left 2
SYMATTR InstName Q5
SYMATTR Value 2SA1381F
SYMBOL npn 416 -176 M0
SYMATTR InstName Q7
SYMATTR Value 2SC3503F
SYMBOL res 336 624 R0
SYMATTR InstName R7
SYMATTR Value 10
SYMBOL res 528 624 R0
SYMATTR InstName R16
SYMATTR Value 10
SYMBOL diode -624 240 R90
WINDOW 0 0 32 VBottom 2
WINDOW 3 32 32 VTop 2
SYMATTR InstName D3
SYMATTR Value BAV21
SYMBOL diode 432 -720 R90
WINDOW 0 0 32 VBottom 2
WINDOW 3 32 32 VTop 2
SYMATTR InstName D4
SYMATTR Value BAV21
SYMBOL res 336 256 R0
SYMATTR InstName R2
SYMATTR Value 1k
TEXT -48 -1488 Left 2 !;op
TEXT -752 -1344 Left 2 !.option plotwinsize=0
TEXT -752 -1312 Left 2 !.option noopiter
TEXT -752 -1616 Left 2 ;Transient
TEXT -752 -1456 Left 2 !.four {freq} 10 10 v(SPK+,SPK-)
TEXT -48 -1520 Left 2 !.param prb=0
TEXT -752 -1520 Left 2 !.param timestep {1/((262144/8)*freq)}
TEXT -752 -1552 Left 2 !.param freq 1k
TEXT -752 -1488 Left 2 !.param stoptime {iterations/freq}
TEXT -48 -1584 Left 2 !;ac oct 100 10 100meg
TEXT -48 -1552 Left 2 ;.step param prb list -1 1
TEXT -48 -1616 Left 2 ;AC analysis
TEXT -752 -1424 Left 2 !.param iterations 100
TEXT -416 -1280 Left 2 !.lib usr/ONNN_BJT.lib
TEXT -48 -1280 Left 2 !.param Zimp 6
TEXT 1920 -1120 Left 2 !.param Zreal Zimp/2
TEXT 1920 -1088 Left 2 !.param Zimg (Zimp*sqrt(3))/(4*pi*freq)
TEXT -48 -1248 Left 2 !.param supplyPWR 100
TEXT -48 -1216 Left 2 !.param supplyVLT 24
TEXT -416 -1216 Left 2 !.lib usr/STM_D.lib
TEXT -416 -1312 Left 2 !.lib usr/FCS_BJT.lib
TEXT -48 -1312 Left 2 !.param voutput 35
TEXT -48 -1184 Left 2 !.param supplyK 0.06
TEXT 2704 -448 Left 2 !.param rser {(supplyVLT*supplyVLT*supplyK)/(2*supplyPWR)}
TEXT -752 -1584 Left 2 !.tran 0 {stoptime} 1n {timestep}
TEXT 2704 -416 Left 2 !.param phi 90
TEXT 304 -1312 Left 2 !.param con1_len 15
TEXT 2704 -480 Left 2 !KCON1 LVCC LSGND LGSPK1 LGSPK2 LPGND LPWRGND1 LPWRGND2 LVEE LDGND 0.8
TEXT 304 -1280 Left 2 !.param con2_len 15m
TEXT 1920 -1152 Left 2 !KCON2 LSPKP LOUTR LSPKN1 LSPKN2 0.8
TEXT 2288 -272 Left 2 !KOTR LTRF LTRR 0.9
TEXT 1904 -1616 Left 2 ;Konektor zvucnika i zvucnik
TEXT 2672 -1616 Left 2 ;Konektor napajanja, star ground i napajanje
TEXT 688 -1616 Left 2 ;Negativna povratna sprega
TEXT -48 -1344 Left 2 ;Ulazni parametri kola
TEXT 2288 -304 Left 2 ;Izlazni transformator
TEXT 2464 80 Center 2 ;AC sonda
TEXT 3464 -1048 Left 2 ;Masa digitalnog \ndela dolazi sa \nupravljacke ploce.
TEXT -416 -1344 Left 2 !.lib usr/FCS_D.lib
TEXT 304 -1248 Left 2 !.param BIAS 0.52
TEXT 304 -1216 Left 2 !.param OFFSET 0.5
TEXT 1904 -976 Left 2 ;Kolo za ponistavanje offset-a
TEXT -416 -1248 Left 2 !.lib usr/ONNN_D.lib
TEXT -1352 -424 Left 2 !.param ltp_re 51
RECTANGLE Normal -96 -1632 -768 -1392
RECTANGLE Normal -96 -1152 -768 -1360
RECTANGLE Normal 608 -1632 -64 -1392
RECTANGLE Normal 608 -1152 -64 -1360
RECTANGLE Normal 3840 -384 2656 -1632 2
RECTANGLE Normal 2592 -1056 1888 -1632 2
RECTANGLE Normal 2592 -256 2272 -320 2
RECTANGLE Normal 2288 16 2160 -176 2
RECTANGLE Normal 2592 544 2336 64 2
RECTANGLE Normal 3088 -720 2864 -1584 2
RECTANGLE Normal 2288 -1200 2064 -1584 2
RECTANGLE Normal 2368 16 2288 -176 2
RECTANGLE Normal 1504 -1296 1392 -1584 2
RECTANGLE Normal 1824 -1152 672 -1632 2
RECTANGLE Normal 2592 -384 1888 -992 2

The netlist it stands for:
* nano.asc
R12 nfb offset 100
V2 N042 0 SINE(0 {supplyVLT*sqrt(2)} 50 0 0 {phi}) Rser={rser}
Ii xp x 0 AC {u(prb)}
Vi x AC2 0 AC {u(-prb)}
R33 N055 N052 100
R34 N055 sgnd 1k8
D7 preout vcc+ 1N5404
D8 vcc- preout 1N5404
LTRF out1 N058 2µ Rser=10m Rpar=3meg Cpar=1p
R19 out1 N058 2.2
R20 N004 nfb 1k8
V1 x AC1 0
D6 N042 N003 GBPC3502
D9 N026 N043 GBPC3502
V3 0 N043 SINE(0 {supplyVLT*sqrt(2)} 50 0 0 {phi}) Rser={rser}
R54 out1 N060 4.7
R60 SPK+ N011 {Zreal}
L19 N011 SPK- {Zimg} Cpar=10p
V18 xp pwrgnd 0
Q16 vcc+ N048 N051 0 MJL3281A
Q17 vcc- N067 N062 0 CA_MJE15033C
Q18 vcc+ N046 N047 0 CA_MJE15032C
Q19 vcc- N063 N061 0 MJL1302A
R22 N063 N062 2
R23 N048 N047 2
C20 vcc+ pwrgnd 100n Rser=700m Lser=7n Rpar=4.4meg Cpar=1p
L10 N051 preout 40n Rser=220m Cpar=3p
L11 preout N061 40n Rser=220m Cpar=3p
C24 N060 pwrgnd 47n Rser=700m Lser=7n Rpar=4.4meg Cpar=1p
C25 pwrgnd vcc- 100n Rser=700m Lser=7n Rpar=4.4meg Cpar=1p
C2 offset sgnd 2200µ V=10 Irms=1.25 Rser=0.08 Lser=10n Rpar=110k Cpar=3p
C6 N035 N026 6800µ V=50 Irms=2.5 Rser=0.08 Lser=20n Rpar=40k Cpar=3p mfg="Nichicon" pn="UVZ1H682MRD" type="Al electrolytic"
R§PBIAS1 N056 N059 {1+(500*BIAS)}
R52 N039 N056 1k2
D10 N043 N003 GBPC3502
D11 N026 N042 GBPC3502
LVCC vcc+ N002 {con1_len*20n} Rser={con1_len*.5m}
LVEE vcc- N034 {con1_len*20n} Rser={con1_len*.5m}
R46 out1 N005 100
LTRR out2 N057 2µ Rser=80m Rpar=3meg Cpar=1p
Q3 N066 N064 N071 0 2SC3503F
C4 sgnd N055 2n2
V11 sinus sgnd SINE(0 {voutput/18} {freq})
R1 N047 N062 33
Q21 N045 N056 N066 0 MJE340
LGSPK2 gspk N015 {con1_len*20n} Rser={con1_len*.5m}
LPWRGND2 pwrgnd N020 {con1_len*20n} Rser={con1_len*.5m}
LPGND pgnd N016 {con1_len*20n} Rser={con1_len*.5m}
LSGND sgnd N007 {con1_len*20n} Rser={con1_len*.5m}
R18 N003 N002 25m
R26 N013 N015 25m
R28 dgnd N020 25m
R29 N017 N016 25m
R32 N008 N007 25m
R38 N026 N034 25m
L4 dgnd N028 2n Rser=1m
L5 N017 dgnd 2n Rser=1m
L6 N013 N017 2n Rser=1m
L18 N008 N013 2n Rser=1m
LSPKP SPKP N001 {con2_len*20n} Rser={con2_len*.5m}
LOUTR SPKE N006 {con2_len*20n} Rser={con2_len*.5m}
LSPKN2 gspk N014 {con2_len*20n} Rser={con2_len*.5m}
R35 SPKE N057 20m
R39 SPKP N058 20m
R41 SPK+ N001 25m
R42 SPK+ N006 25m
R43 SPK- N014 25m
LDGND pwrgnd N025 {con1_len*20n} Rser={con1_len*.5m}
R31 dgnd N025 25m
LPWRGND1 pwrgnd N018 {con1_len*20n} Rser={con1_len*.5m}
R25 dgnd N018 25m
V7 N037 sgnd PULSE(0 {voutput/18} 1u 1n 1n {1/(freq*2)} {1/freq})
V8 impulse N037 PULSE(0 {-voutput/18} {1u+(1/(freq*2))} 1n 1n {1/(freq*2)} {1/freq})
C11 N052 sinus 220µ V=6.3 Irms=290m Rser=0.5 Lser=3n Rpar=100k Cpar=3p mfg="Nichicon" pn="UPW0J221MED1TD" type="Al electrolytic"
C14 vcc+ pwrgnd 1000µ V=63 Irms=2.77 Rser=0.036 Lser=5n Rpar=100k Cpar=3p mfg="Nichicon" pn="UPW1J102MHD6" type="Al electrolytic"
C17 pwrgnd vcc- 1000µ V=63 Irms=2.77 Rser=0.036 Lser=5n Rpar=100k Cpar=3p mfg="Nichicon" pn="UPW1J102MHD6" type="Al electrolytic"
C16 N003 N036 6800µ V=50 Irms=2.5 Rser=0.08 Lser=20n Rpar=40k Cpar=3p mfg="Nichicon" pn="UVZ1H682MRD" type="Al electrolytic"
C22 N027 N026 6800µ V=50 Irms=2.5 Rser=0.08 Lser=20n Rpar=40k Cpar=3p mfg="Nichicon" pn="UVZ1H682MRD" type="Al electrolytic"
C23 N003 N029 6800µ V=50 Irms=2.5 Rser=0.08 Lser=20n Rpar=40k Cpar=3p mfg="Nichicon" pn="UVZ1H682MRD" type="Al electrolytic"
L3 N027 N028 2n Rser=1m
L7 N035 0 2n Rser=1m
L8 N028 N029 2n Rser=1m
L9 0 N036 2n Rser=1m
L12 N028 0 2n Rser=1m
R37 N059 N066 200
R51 vcc+ N033 100k
R62 N044 vcc- 100k
D13 N033 sgnd MMSD4148
D14 sgnd N044 MMSD4148
R§POFFSET1 N033 N040 {1+(10k*OFFSET)}
R§POFFSET2 N040 N044 {1+(10k*(1-OFFSET))}
R65 N041 N040 1k
C26 sgnd N041 22µ V=50 Irms=90m Rser=2 Lser=2n Rpar=2meg Cpar=2p mfg="Panasonic" pn="ECEA1HN220U" type="Al bipolar"
R66 offset N041 22k
V4 AC1 preout 0
V6 out1 AC2 0
R68 N067 N066 22
R69 N046 N045 22
LGSPK1 gspk N012 {con1_len*20n} Rser={con1_len*.5m}
R78 N013 N012 25m
LSPKN1 gspk N010 {con2_len*20n} Rser={con2_len*.5m}
R79 SPK- N010 25m
V9 N038 sgnd SINE(0 {voutput/72} 19k)
V10 N031 N038 SINE(0 {voutput/72} 17k)
L2 N004 N005 20n
L13 N004 out2 20n
Q1 N069 N065 N070 0 2SC3503F
R10 N045 N039 11
C8 N045 N066 47µ V=6.3 Irms=290m Rser=0.5 Lser=3n Rpar=100k Cpar=3p mfg="Nichicon" pn="UPW0J221MED1TD" type="Al electrolytic"
R13 vcc+ N021 33
R14 vcc+ N022 33
C18 N050 N066 180p
Q14 N064 N055 N053 0 CA_BC560C
Q20 N065 nfb N054 0 CA_BC560C
R11 N072 vcc- 43
R36 N065 vcc- 750
R44 N064 vcc- 750
Q15 N049 N032 N030 0 2SA1381F
R27 vcc+ N030 100
R40 N032 vcc- 24k
C9 N039 N066 100n Rser=30m Lser=3n Rpar=700k
R8 nfb N050 10
R9 N004 N009 2k2
C19 N009 nfb 10p
V12 N023 N031 SINE(0 {voutput/72} 3k)
V13 imd N023 SINE(0 {voutput/72} 5k)
D1 vcc+ N019 BAV21
D2 N019 N032 BAV21
R24 N049 N053 {ltp_re}
R30 N049 N054 {ltp_re}
Q2 N039 N024 N022 0 2SA1381F
Q5 N024 N024 N021 0 2SA1381F
Q7 N024 sgnd N068 0 2SC3503F
R7 N070 N072 10
R16 N071 N072 10
D3 N065 N064 BAV21
D4 N039 N024 BAV21
R2 N068 N069 1k
.model D D
.lib standard.dio
.model NPN NPN
.model PNP PNP
.lib standard.bjt
;op
.option plotwinsize=0
.option noopiter
* Transient
.four {freq} 10 10 v(SPK+,SPK-)
.param prb=0
.param timestep {1/((262144/8)*freq)}
.param freq 1k
.param stoptime {iterations/freq}
;ac oct 100 10 100meg
* .step param prb list -1 1
* AC analysis
.param iterations 100
.lib usr/ONNN_BJT.lib
.param Zimp 6
.param Zreal Zimp/2
.param Zimg (Zimp*sqrt(3))/(4*pi*freq)
.param supplyPWR 100
.param supplyVLT 24
.lib usr/STM_D.lib
.lib usr/FCS_BJT.lib
.param voutput 35
.param supplyK 0.06
.param rser {(supplyVLT*supplyVLT*supplyK)/(2*supplyPWR)}
.tran 0 {stoptime} 1n {timestep}
.param phi 90
.param con1_len 15
KCON1 LVCC LSGND LGSPK1 LGSPK2 LPGND LPWRGND1 LPWRGND2 LVEE LDGND 0.8
.param con2_len 15m
KCON2 LSPKP LOUTR LSPKN1 LSPKN2 0.8
KOTR LTRF LTRR 0.9
* Konektor zvucnika i zvucnik
* Konektor napajanja, star ground i napajanje
* Negativna povratna sprega
* Ulazni parametri kola
* Izlazni transformator
* AC sonda
* Masa digitalnog
* dela dolazi sa
* upravljacke ploce.
.lib usr/FCS_D.lib
.param BIAS 0.52
.param OFFSET 0.5
* Kolo za ponistavanje offset-a
.lib usr/ONNN_D.lib
.param ltp_re 51
.backanno
.end